# EAGLE design LD_DRV_CK (EAGLE 7.2.0)
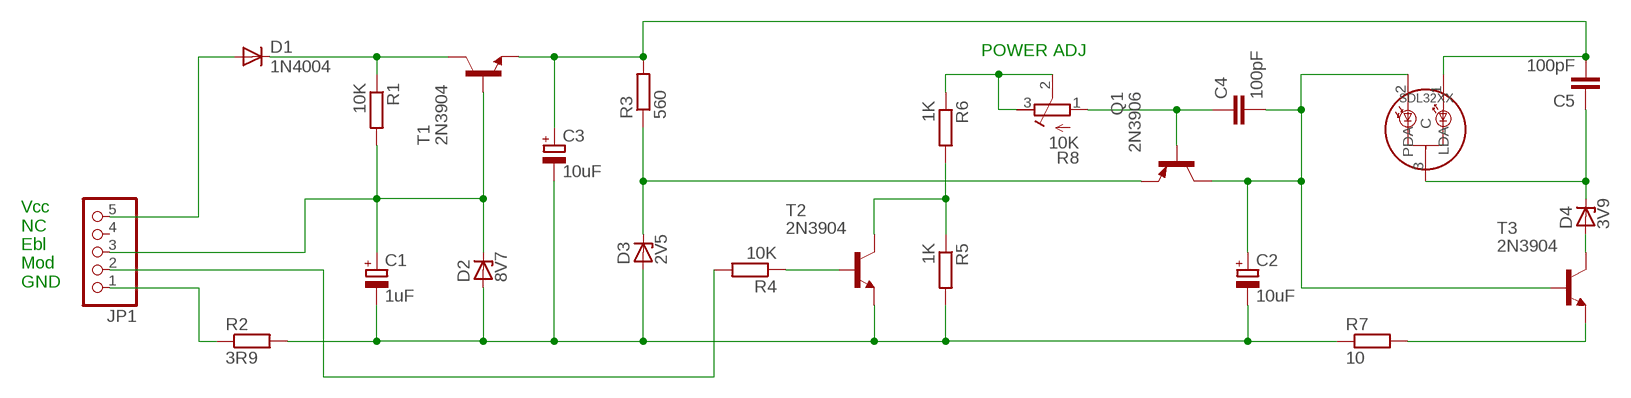
[diagram p0: schematic, sheet 1]

## Parts
C1  1uF  CPOL-EUE2,5-6E  [E2,5-6E]
C2  10uF  CPOL-EUE2,5-6E  [E2,5-6E]
C3  10uF  CPOL-EUE2,5-6E  [E2,5-6E]
C4  100pF  C-EU025-030X050  [C025-030X050]
C5  100pF  C-EU025-030X050  [C025-030X050]
D1  1N4004  [DO41-10]
D2  8V7  ZENER-DIODEZD-10  [ZDIO-10]
D3  2V5  ZENER-DIODEZD-10  [ZDIO-10]
D4  3V9  ZENER-DIODEZD-10  [ZDIO-10]
JP1  PINHD-1X5/90  [1X05/90]
Q1  2N3906  [TO92]
R1  10K  R-EU_0207/10  [0207/10]
R2  3R9  R-EU_0207/10  [0207/10]
R3  560  R-EU_0207/10  [0207/10]
R4  10K  R-EU_0207/10  [0207/10]
R5  1K  R-EU_0207/10  [0207/10]
R6  1K  R-EU_0207/10  [0207/10]
R7  10  R-EU_0207/10  [0207/10]
R8  10K  R-TRIMM3339P  [RTRIM3339P]
SLD32XX_1  SLD32XX  [SLD32XXVF]
T1  2N3904  [TO92]
T2  2N3904  [TO92]
T3  2N3904  [TO92]

## Nets
N$1: D1.C R1.1 T1.1(C)
N$2: C1.+ D2.C JP1.3 R1.2 T1.2(B)
N$3: C1.- C2.- C3.- D2.A D3.A R2.2 R5.2 R7.1 T2.3(E)
N$4: D3.C Q1.3(E) R3.1
N$5: R4.1 T2.2(B)
N$6: C3.+ C5.2 R3.2 SLD32XX_1.1(LDA) T1.3(E)
N$7: JP1.2 R4.2
N$8: JP1.1 R2.1
N$9: D1.A JP1.5
N$10: R5.1 R6.2 T2.1(C)
N$11: R6.1 R8.2(S) R8.3(E)
N$13: C4.1 Q1.2(B) R8.1(A)
N$14: C2.+ C4.2 Q1.1(C) SLD32XX_1.2(PDA) T3.2(B)
N$16: R7.2 T3.3(E)
N$17: C5.1 D4.C SLD32XX_1.3(C)
N$18: D4.A T3.1(C)
Unconnected: JP1.4

## Notes on the sheet
- POWER ADJ
- Vcc
  NC
  Ebl
  Mod
  GND

## Library data of the parts
C1-C3 = rcl:CPOL-EU: POLARIZED CAPACITOR, European symbol
C4 C5 = rcl:C-EU: CAPACITOR, European symbol
D1 = adafruit:1N4004: DIODE General purpose 1N400x type rectifier (With bigger pads) http://www.ladyada.net/library/pcb/eaglelibrary.html
D2-D4 = diode:ZENER-DIODE: Z-Diode
JP1 = pinhead:PINHD-1X5: PIN HEADER
Q1 = transistor-pnp:2N3906: PNP Transistor
R1-R7 = rcl:R-EU_: RESISTOR, European symbol
R8 = resistor:R-TRIMM: Trimm resistor
SLD32XX_1 = LASER:SLD32XX: SANYO Laser Diode Series 32XX 405 to 450 nM
T1-T3 = transistor:2N3904: NPN TRANSISTOR

## Board
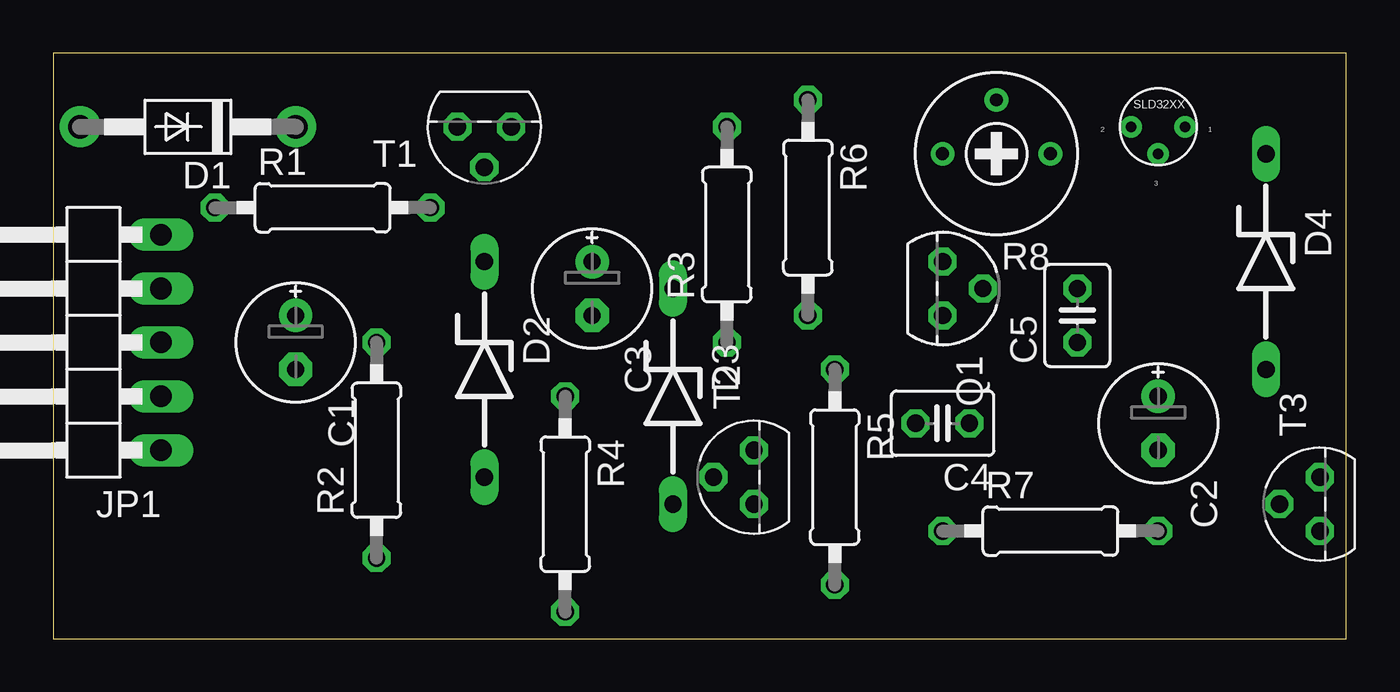
[diagram p1: board, top side]
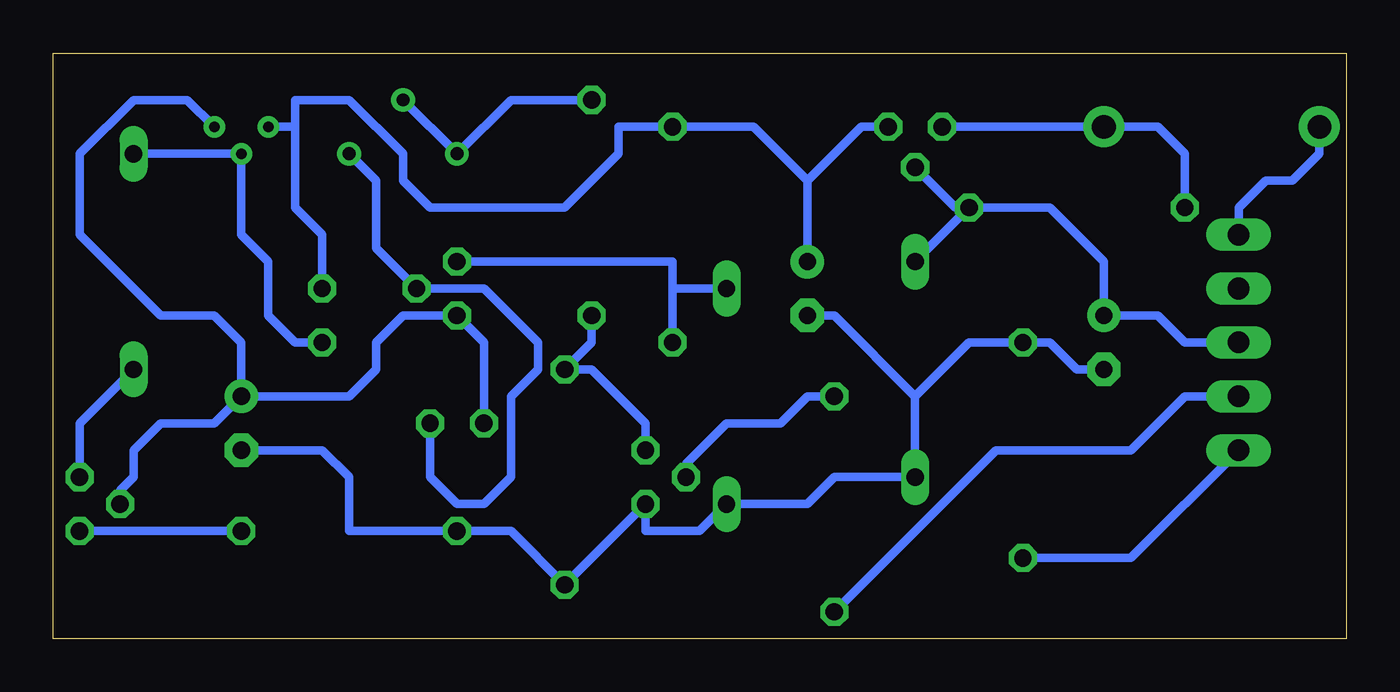
[diagram p2: board, bottom side, seen from below]

Size 60.94 x 27.61 mm. Coordinates in mm from the lower left corner, seen from the top.
Outline: 0,0 60.94,0 60.94,27.61 0,27.61 0,0
Copper layers (1*16): Top 0.035mm / dielectric 1.5mm / Bottom 0.035mm
Design rules "default": minimum track width 10mil, minimum drill 24mil, track to track 8mil, track to pad 8mil, pad to pad 8mil, via to via 8mil, smd to smd 8mil, copper to edge 40mil, drill to drill 8mil, minimum pad ring 10mil, minimum via ring 8mil, stop-mask expansion 4mil, vias tented up to drill 0mil, thermal gap 10mil

### Footprints (pad centres in the part's own frame; a part is rotated, then mirrored left to right if it is on the bottom)
E2,5-6E = drill 0.813 pad 1.575: + -1.27,0 | drill 0.813 pad 1.575 octagon: - 1.27,0
C025-030X050 = drill 0.813 octagon: 1 -1.27,0; 2 1.27,0
DO41-10 = drill 1.118 pad 1.93: A 5.08,0; C -5.08,0
ZDIO-10 = drill 0.813 long: A 5.08,0; C -5.08,0
1X05/90 = drill 1.016 long: 1 -5.08,-3.81; 2 -2.54,-3.81; 3 0,-3.81; 4 2.54,-3.81; 5 5.08,-3.81
TO92 = drill 0.813 octagon: 1 1.27,0; 2 0,1.905; 3 -1.27,0
0207/10 = drill 0.813 octagon: 1 -5.08,0; 2 5.08,0
RTRIM3339P = drill 0.61: 1 -2.54,0; 2 0,-2.54; 3 2.54,0
SLD32XXVF = drill 0.5 pad 0.813: 1 1.27,0; 2 -1.27,0; 3 0,1.27

### Placement (x,y rotation side)
C1  11.43,13.97 270 top
C2  52.07,10.16 270 top
C3  25.4,16.51 270 top
C4  41.91,10.16 180 top
C5  48.26,15.24 90 top
D1  6.35,24.13 180 top
D2  20.32,12.7 270 top
D3  29.21,11.43 270 top
D4  57.15,17.78 270 top
JP1  1.27,13.97 90 top
Q1  41.91,16.51 270 top
R1  12.7,20.32 0 top
R2  15.24,8.89 90 top
R3  31.75,19.05 90 top
R4  24.13,6.35 270 top
R5  36.83,7.62 270 top
R6  35.56,20.32 270 top
R7  46.99,5.08 0 top
R8  44.45,22.86 180 top
SLD32XX_1  52.07,24.13 180 top
T1  20.32,24.13 180 top
T2  33.02,7.62 90 top
T3  59.69,6.35 90 top

### Tracks (layer width: path | path; a pad name or v marks a point on that pad's centre or on a via)
N$1
  Bottom 0.406: R1.1 7.62,22.86 8.89,24.13 D1.C T1.1
N$2
  Bottom 0.406: JP1.3 7.62,13.97 8.89,15.24 C1.+ 11.43,17.78 13.97,20.32 R1.2 | R1.2 D2.C | T1.2 18.41,20.32 R1.2
N$3
  Bottom 0.406: C1.- 12.7,12.7 13.97,13.97 R2.2 17.78,13.97 20.32,11.43 | 20.32,11.43 D2.A 24.13,7.62 25.4,6.35 D3.A 30.48,5.08 33.02,5.08 T2.3 R5.2 39.37,5.08 R7.1 46.99,5.08 46.99,7.62 48.26,8.89 C2.- | 20.32,11.43 24.13,15.24 C3.-
N$4
  Bottom 0.406: D3.C 31.75,16.51 | R3.1 31.75,16.51 | 31.75,16.51 31.75,17.78 Q1.3
N$5
  Bottom 0.406: R4.1 25.4,11.43 26.67,10.16 29.21,10.16 31.11,8.26 T2.2
N$6
  Bottom 0.406: T1.3 22.86,24.13 25.4,21.59 | 25.4,21.59 C3.+ | 25.4,21.59 27.94,24.13 R3.2 34.29,24.13 34.29,22.86 36.83,20.32 43.18,20.32 44.45,21.59 44.45,22.86 46.99,25.4 49.53,25.4 49.53,24.13 | SLD32XX_1.1 49.53,24.13 | 49.53,24.13 49.53,20.32 48.26,19.05 C5.2
N$7
  Bottom 0.406: JP1.2 7.62,11.43 10.16,8.89 16.51,8.89 R4.2
N$8
  Bottom 0.406: R2.1 10.16,3.81 JP1.1
N$9
  Bottom 0.406: JP1.5 5.08,20.32 3.81,21.59 2.54,21.59 1.27,22.86 D1.A
N$10
  Bottom 0.406: T2.1 33.02,10.16 35.56,12.7 R5.1 35.56,13.97 R6.2
N$11
  Bottom 0.406: R6.1 39.37,25.4 R8.3 R8.2
N$13
  Bottom 0.406: C4.1 43.18,7.62 41.91,6.35 40.64,6.35 39.37,7.62 39.37,11.43 38.1,12.7 38.1,13.97 40.64,16.51 Q1.2 45.72,18.41 45.72,21.59 R8.1
N$14
  Bottom 0.406: C4.2 40.64,13.97 Q1.1 44.45,15.24 45.72,13.97 45.72,12.7 46.99,11.43 C2.+ | SLD32XX_1.2 54.61,25.4 57.15,25.4 59.69,22.86 59.69,19.05 55.88,15.24 53.34,15.24 52.07,13.97 C2.+ | C2.+ 53.34,10.16 55.88,10.16 57.15,8.89 57.15,7.62 57.78,6.99 T3.2
N$16
  Bottom 0.406: R7.2 T3.3
N$17
  Bottom 0.406: D4.C SLD32XX_1.3 52.07,19.05 50.8,17.78 50.8,15.24 49.53,13.97 C5.1
N$18
  Bottom 0.406: D4.A 59.69,10.16 T3.1